# Altium schematic sheet Defectoscope.SchDoc: Плата трехосевого
size 840 x 594 mm; ApprovedBy: Алексеев; CheckedBy: Алексеев; DrawnBy: Подлесный; DocumentNumber: 55834732.2212.02 Э3; SheetNumber: 1; SheetTotal: 2; Title1str: датчика; DocumentType: Схема электрическая принципиальная; Format: A1; ImagePath: Введите номер платы
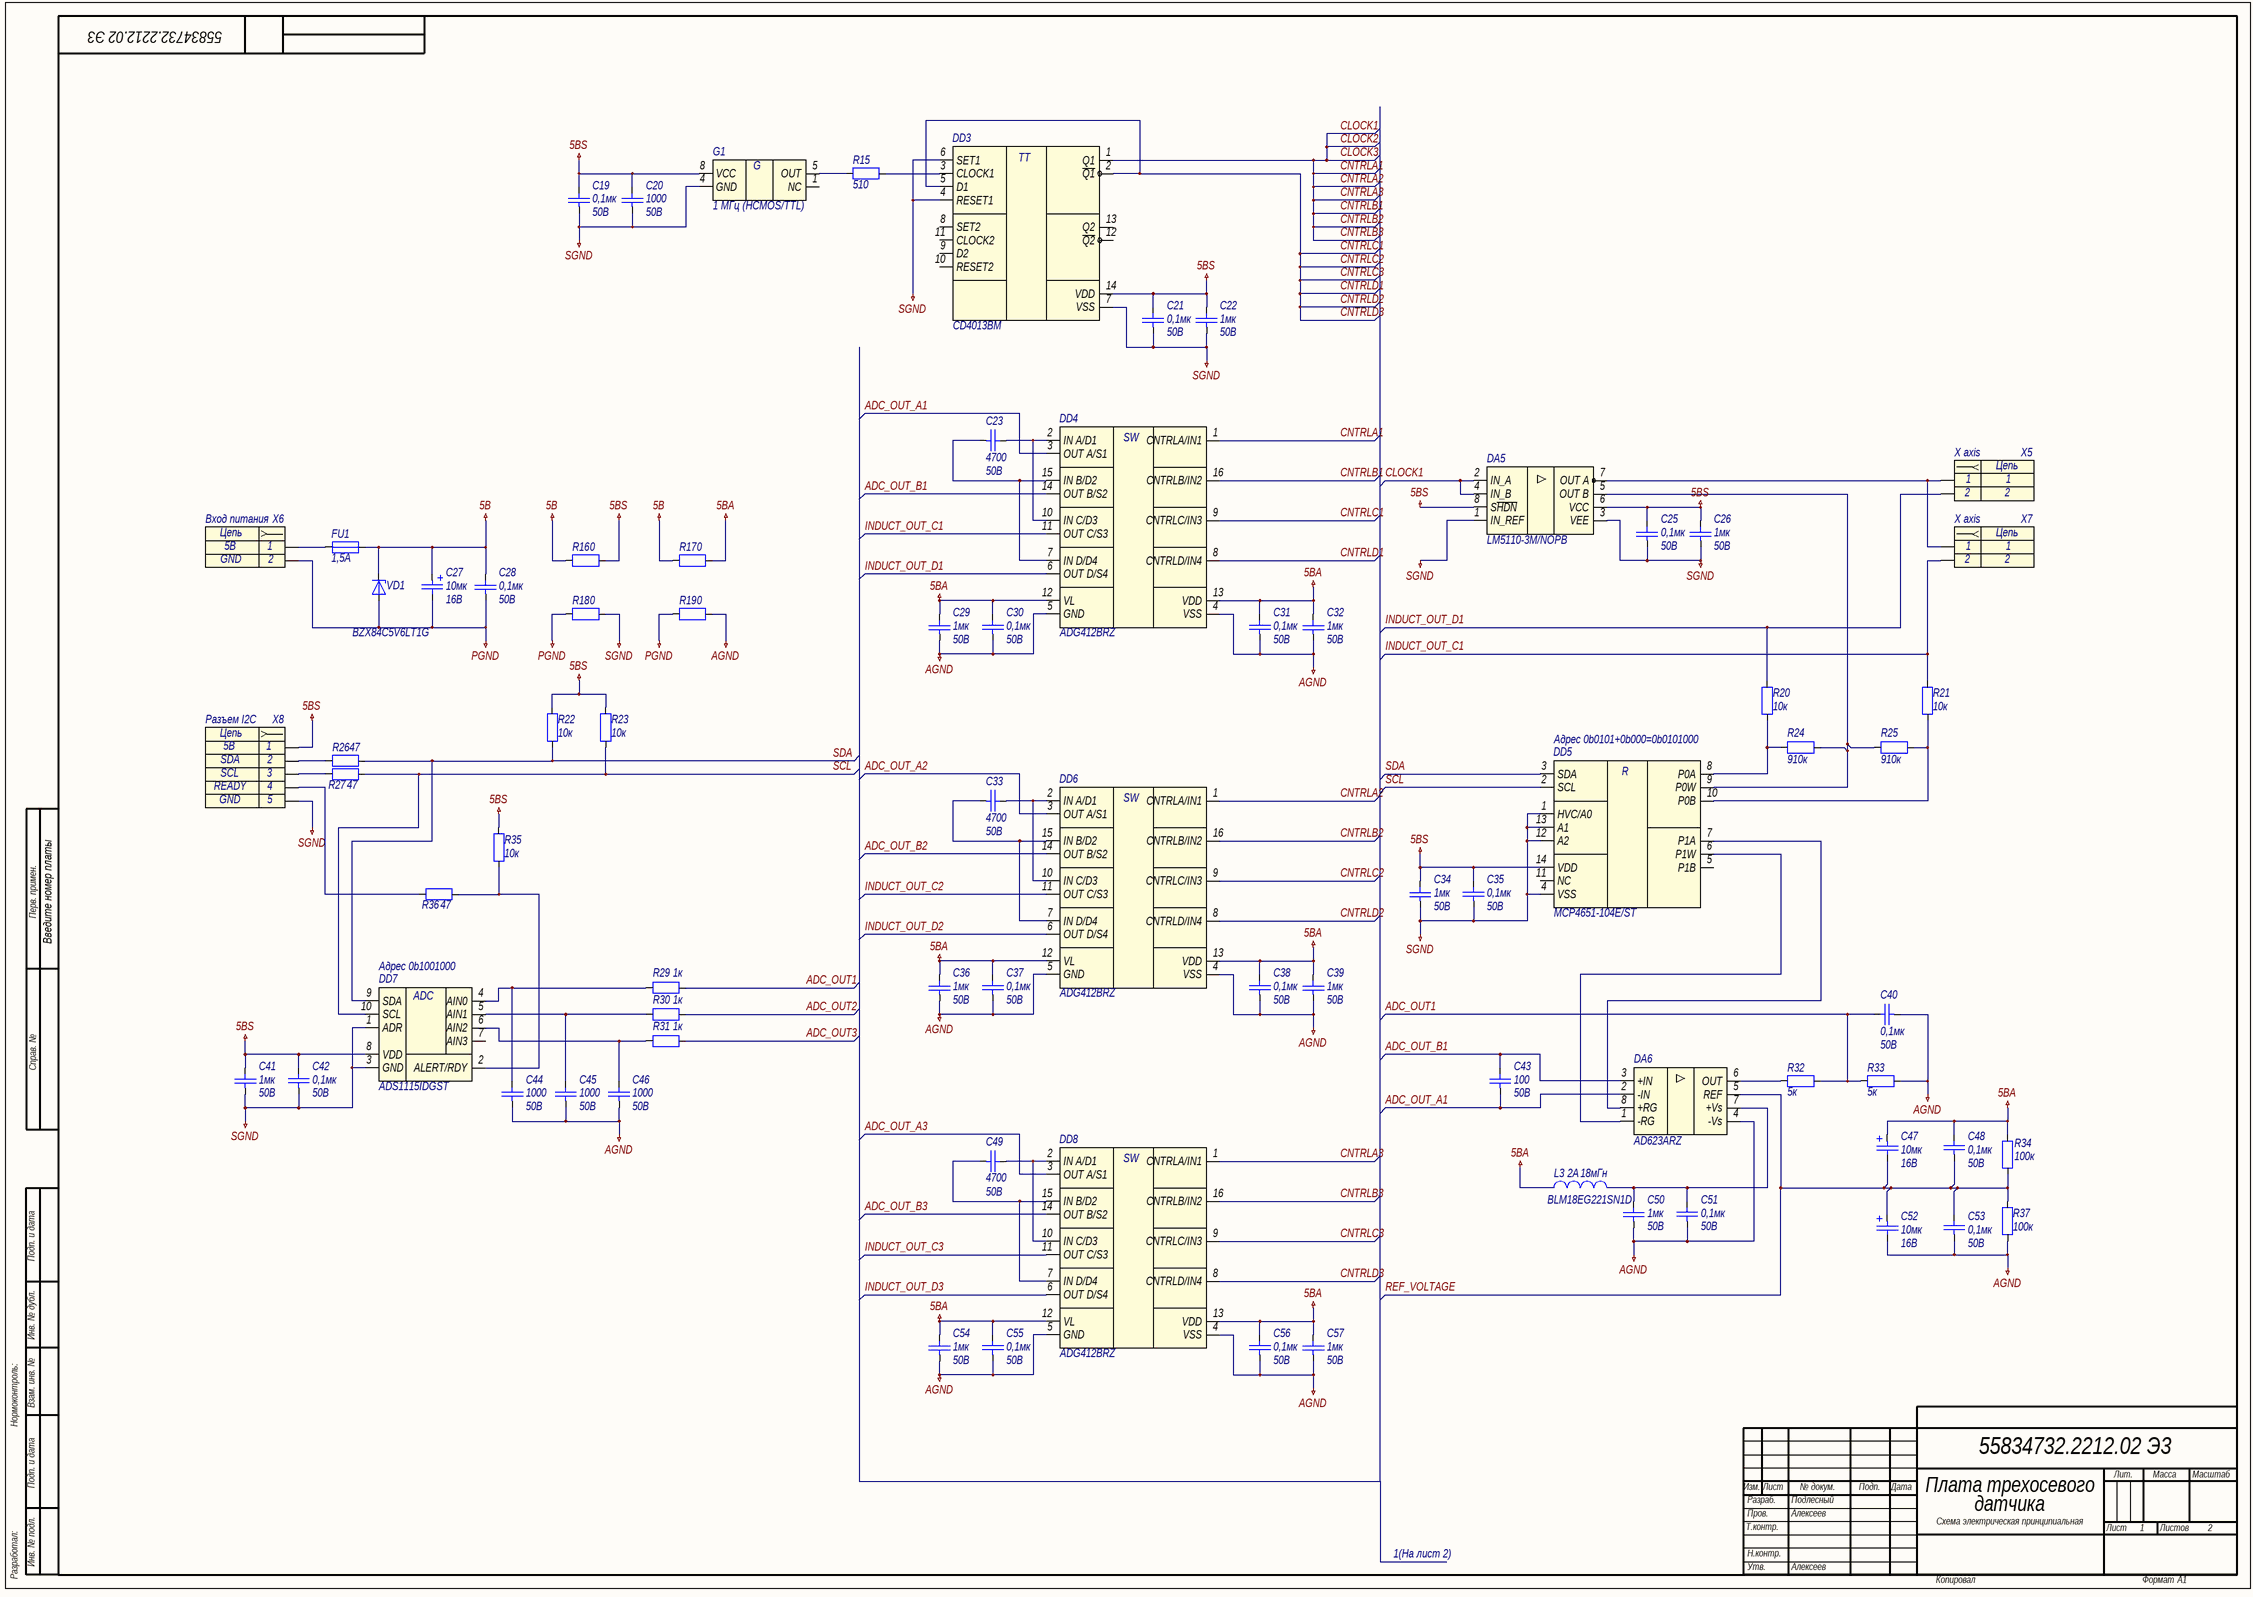
[diagram p0: Defectoscope.SchDoc]

## Parts
C19  Voltage: 50В  [C0805]  (hidden comment: 0,1мк)
C20  Voltage: 50В  [C0805]  (hidden comment: 1000)
C21  Voltage: 50В  [C0805]  (hidden comment: 0,1мк)
C22  Voltage: 50В  [C0805]  (hidden comment: 1мк)
C23  Voltage: 50В  [C0805]  (hidden comment: 4700)
C25  Voltage: 50В  [C0805]  (hidden comment: 0,1мк)
C26  Voltage: 50В  [C0805]  (hidden comment: 1мк)
C27  10мк  Voltage: 16В  [TANTAL CASE B]
C28  Voltage: 50В  [C0805]  (hidden comment: 0,1мк)
C29  Voltage: 50В  [C0805]  (hidden comment: 1мк)
C30  Voltage: 50В  [C0805]  (hidden comment: 0,1мк)
C31  Voltage: 50В  [C0805]  (hidden comment: 0,1мк)
C32  Voltage: 50В  [C0805]  (hidden comment: 1мк)
C33  Voltage: 50В  [C0805]  (hidden comment: 4700)
C34  Voltage: 50В  [C0805]  (hidden comment: 1мк)
C35  Voltage: 50В  [C0805]  (hidden comment: 0,1мк)
C36  Voltage: 50В  [C0805]  (hidden comment: 1мк)
C37  Voltage: 50В  [C0805]  (hidden comment: 0,1мк)
C38  Voltage: 50В  [C0805]  (hidden comment: 0,1мк)
C39  Voltage: 50В  [C0805]  (hidden comment: 1мк)
C40  Voltage: 50В  [C0805]  (hidden comment: 0,1мк)
C41  Voltage: 50В  [C0805]  (hidden comment: 1мк)
C42  Voltage: 50В  [C0805]  (hidden comment: 0,1мк)
C43  Voltage: 50В  [C0805]  (hidden comment: 100)
C44  Voltage: 50В  [C0805]  (hidden comment: 1000)
C45  Voltage: 50В  [C0805]  (hidden comment: 1000)
C46  Voltage: 50В  [C0805]  (hidden comment: 1000)
C47  10мк  Voltage: 16В  [TANTAL CASE B]
C48  Voltage: 50В  [C0805]  (hidden comment: 0,1мк)
C49  Voltage: 50В  [C0805]  (hidden comment: 4700)
C50  Voltage: 50В  [C0805]  (hidden comment: 1мк)
C51  Voltage: 50В  [C0805]  (hidden comment: 0,1мк)
C52  10мк  Voltage: 16В  [TANTAL CASE B]
C53  Voltage: 50В  [C0805]  (hidden comment: 0,1мк)
C54  Voltage: 50В  [C0805]  (hidden comment: 1мк)
C55  Voltage: 50В  [C0805]  (hidden comment: 0,1мк)
C56  Voltage: 50В  [C0805]  (hidden comment: 0,1мк)
C57  Voltage: 50В  [C0805]  (hidden comment: 1мк)
DA5  LM5110-3M/NOPB  [SO8]
DA6  AD623ARZ  [SO8]
DD3  CD4013BM  [SO14]
DD4  ADG412BRZ  [SO-16]
DD5  MCP4651-104E/ST  [TSSOP14]
DD6  ADG412BRZ  [SO-16]
DD7  ADS1115IDGST  [MSOP-10]
DD8  ADG412BRZ  [SO-16]
FU1  value 1,5A  [FUSE812]  (hidden comment: MF-MSMF150)
G1  1 МГц (HCMOS/TTL)  [DIL8]
L3  Name: BLM18EG221SN1D  Imax: 2А  [L0603]  (hidden comment: 18мГн)
R15  510  [R0805]
R16  0  [R0805]
R17  0  [R0805]
R18  0  [R0805]
R19  0  [R0805]
R20  10к  [R0805]
R21  10к  [R0805]
R22  10к  [R0805]
R23  10к  [R0805]
R24  910к  [R0805]
R25  910к  [R0805]
R26  47  [R0805]
R27  47  [R0805]
R29  1к  [R0805]
R30  1к  [R0805]
R31  1к  [R0805]
R32  5к  [R0805]
R33  5к  [R0805]
R34  100к  [R0805]
R35  10к  [R0805]
R36  47  [R0805]
R37  100к  [R0805]
VD1  BZX84C5V6LT1G  [SOT23-3]
X5  X axis  [MW-2M]
X6  Вход питания  [MW-2M]
X7  X axis  [MW-2M]
X8  Разъем I2C  [MW-5M]

## Nets
5B: C27.1 C28.2 FU1.2 R16.2 R17.2 VD1.1(K)
5BA: C29.2 C30.2 C31.2 C32.2 C36.2 C37.2 C38.2 C39.2 C47.1 C48.2 C54.2 C55.2 C56.2 C57.2 DD4.12(VL) DD4.13(VDD) DD6.12(VL) DD6.13(VDD) DD8.12(VL) DD8.13(VDD) L3.1 R17.1 R34.2
5BS: C19.2 C20.2 C21.2 C22.2 C25.2 C26.2 C34.2 C35.2 C41.2 C42.2 DA5.6(VCC) DA5.8(S~{HDN}) DD3.14(VDD) DD5.14(VDD) DD7.8(VDD) G1.8(VCC) R16.1 R22.2 R23.2 R35.2 X8.1
AGND: C29.1 C30.1 C31.1 C32.1 C36.1 C37.1 C38.1 C39.1 C40.1 C44.1 C45.1 C46.1 C50.1 C51.1 C52.2 C53.1 C54.1 C55.1 C56.1 C57.1 DA6.4(-Vs) DD4.4(VSS) DD4.5(GND) DD6.4(VSS) DD6.5(GND) DD8.4(VSS) DD8.5(GND) R19.1 R33.1 R37.1
PGND: C27.2 C28.1 R18.2 R19.2 VD1.2(A) X6.2
SGND: C19.1 C20.1 C21.1 C22.1 C25.1 C26.1 C34.1 C35.1 C41.1 C42.1 DA5.1(IN_REF) DA5.3(VEE) DD3.4(RESET1) DD3.6(SET1) DD3.7(VSS) DD5.1(HVC/A0) DD5.4(VSS) DD5.12(A2) DD5.13(A1) DD7.1(ADR) DD7.3(GND) G1.4(GND) R18.1 X8.5
ADC_OUT1: C40.2 R29.2 R32.1 R33.2
ADC_OUT2: R30.2
ADC_OUT3: R31.2
ADC_OUT_A1: C43.1 DA6.2(-IN) DD4.3(OUT_A/S1)
ADC_OUT_A2: DD6.3(OUT_A/S1)
ADC_OUT_A3: DD8.3(OUT_A/S1)
ADC_OUT_B1: C43.2 DA6.3(+IN) DD4.14(OUT_B/S2)
ADC_OUT_B2: DD6.14(OUT_B/S2)
ADC_OUT_B3: DD8.14(OUT_B/S2)
CLOCK1: DA5.2(IN_A) DA5.4(IN_B) DD3.1(Q1) DD4.1(CNTRLA/IN1) DD4.16(CNTRLB/IN2) DD6.1(CNTRLA/IN1) DD6.16(CNTRLB/IN2) DD8.1(CNTRLA/IN1) DD8.16(CNTRLB/IN2)  [also labelled CLOCK2, CLOCK3, CNTRLA1, CNTRLA2, CNTRLA3, CNTRLB1, CNTRLB2, CNTRLB3]
CNTRLC1: DD3.2(~{Q1}) DD3.5(D1) DD4.8(CNTRLD/IN4) DD4.9(CNTRLC/IN3) DD6.8(CNTRLD/IN4) DD6.9(CNTRLC/IN3) DD8.8(CNTRLD/IN4) DD8.9(CNTRLC/IN3)  [also labelled CNTRLC2, CNTRLC3, CNTRLD1, CNTRLD2, CNTRLD3]
INDUCT_OUT_C1: DD4.11(OUT_C/S3) R21.1 X7.2
INDUCT_OUT_C2: DD6.11(OUT_C/S3)
INDUCT_OUT_C3: DD8.11(OUT_C/S3)
INDUCT_OUT_D1: DD4.6(OUT_D/S4) R20.1 X5.2
INDUCT_OUT_D2: DD6.6(OUT_D/S4)
INDUCT_OUT_D3: DD8.6(OUT_D/S4)
REF_VOLTAGE: C47.2 C48.1 C52.1 C53.2 DA6.5(REF) R34.1 R37.2
SCL: DD5.2(SCL) DD7.10(SCL) R23.1 R27.1
SDA: DD5.3(SDA) DD7.9(SDA) R22.1 R26.1
NetC23_1: C23.1 DD4.7(IN_D/D4) DD4.15(IN_B/D2)
NetC23_2: C23.2 DD4.2(IN_A/D1) DD4.10(IN_C/D3)
NetC33_1: C33.1 DD6.7(IN_D/D4) DD6.15(IN_B/D2)
NetC33_2: C33.2 DD6.2(IN_A/D1) DD6.10(IN_C/D3)
NetC44_2: C44.2 DD7.4(AIN0) R29.1
NetC45_2: C45.2 DD7.5(AIN1) R30.1
NetC46_2: C46.2 DD7.6(AIN2) R31.1
NetC49_1: C49.1 DD8.7(IN_D/D4) DD8.15(IN_B/D2)
NetC49_2: C49.2 DD8.2(IN_A/D1) DD8.10(IN_C/D3)
NetC50_2: C50.2 C51.2 DA6.7(+Vs) L3.2
NetDA5_5: DA5.5(OUT_B) DD5.9(P0W) R24.2 R25.1
NetDA5_7: DA5.7(OUT_A) X5.1 X7.1
NetDA6_1: DA6.1(-RG) DD5.6(P1W)
NetDA6_6: DA6.6(OUT) R32.2
NetDA6_8: DA6.8(+RG) DD5.7(P1A)
NetDD3_3: DD3.3(CLOCK1) R15.1
NetDD5_8: DD5.8(P0A) R20.2 R24.1
NetDD5_10: DD5.10(P0B) R21.2 R25.2
NetDD7_2: DD7.2(ALERT/RDY) R35.1 R36.1
NetFU1_1: FU1.1 X6.1
NetG1_5: G1.5(OUT) R15.2
NetR26_2: R26.2 X8.2
NetR27_2: R27.2 X8.3
NetR36_2: R36.2 X8.4

Not connected (* = marked no-connect by the designer): DD3 8(SET2) 9(D2) 10(RESET2) 11(CLOCK2) 12(~{Q2}) 13(Q2); DD5 5(P1B) 11(NC); DD7 7(AIN3); G1 1(NC)

## Notes on the sheet
- (near DD5) Адрес 0b0101+0b000=0b0101000
- Перв. примен.
- (near DD7) Адрес 0b1001000
- Справ. №
- Подп. и дата
- Инв. № дубл.
- Нормоконтроль:
- Взам. инв. №
- Изм.
- Лист
- № докум.
- Подп.
- Дата
- Лит.
- Масса
- Масштаб
- Т.контр.
- Пров.
- Разраб.
- Листов
- Разработал:
- Инв. № подл.
- 1(На лист 2)
- Н.контр.
- Утв.
- Копировал
- Формат
- (in symbol ADG412BRZ) SW
- (in symbol ADS1115) ADC
- (in symbol CD4013B) TT
- (in symbol Crystal Oscillator DIP) G
- (in symbol Header_2_sct) Цепь
- (in symbol Header_5_sct) Цепь
- (in symbol MCP4651-103) R

## Library data of the parts
C19-C23 C25 C26 C28-C46 C48-C51 C53-C57 = Capacitor: Конденсатор
  C19 C21 C25 C28 C30 C31 C35 C37 C38 C40 C42 C48 C51 C53 C55 C56: Value: 0,1мк
  C20 C44-C46: Value: 1000
  C22 C26 C29 C32 C34 C36 C39 C41 C50 C54 C57: Value: 1мк
  C23 C33 C49: Value: 4700
  C43: Value: 100
C27 C47 C52 = Capacitor_pol: Конденсатор полярный; Value: 10мк
DA5 = LM5110: Драйвер затвора; Name: LM5110-3M/NOPB
DA6 = AD623ARZ: Инструментальный усилитель ±6В; Name: AD623ARZ
DD3 = CD4013B: CMOS Dual D-Type Flip-Flop; Name: CD4013BM
DD4 DD6 DD8 = ADG412BRZ: CMOS Bilateral Switch; Name: ADG412BRZ
DD5 = MCP4651-103: Dual I2C Digital Potentiometer; Name: MCP4651-104E/ST
DD7 = ADS1115: Ultra-Small, Low-Power, 16-Bit  Analog-to-Digital Converter with Internal Reference; Name: ADS1115IDGST
FU1 = Fuse: Предохранитель; Name: MF-MSMF150
G1 = Crystal Oscillator DIP: Кварцевый генератор; Value: 1 МГц; Name: 1 МГц (HCMOS/TTL)
L3 = Inductor: Катушка индуктивности; Value: 18мГн
R15-R27 R29-R37 = Resistor: Резистор
  R15: Value: 510
  R16-R19: Value: 0
  R20-R23 R35: Value: 10к
  R24 R25: Value: 910к
  R26 R27 R36: Value: 47
  R29-R31: Value: 1к
  R32 R33: Value: 5к
  R34 R37: Value: 100к
VD1 = DiodeZener: Стабилитрон; Name: BZX84C5V6LT1G
X5 X7 = Header_2_sct: Разъем - 2 конт. розетка; Contact_1: 1; Contact_2: 2; Name: X axis
X6 = Header_2_sct: Разъем - 2 конт. розетка; Contact_1: 5B; Contact_2: GND; Name: Вход питания
X8 = Header_5_sct: Разъем - 4 конт. розетка; Contact_1: 5B; Contact_2: SDA; Contact_3: SCL; Contact_4: READY; Contact_5: GND; Name: Разъем I2C